# EAGLE design v1.2-no-regulator (EAGLE 9.5.1)
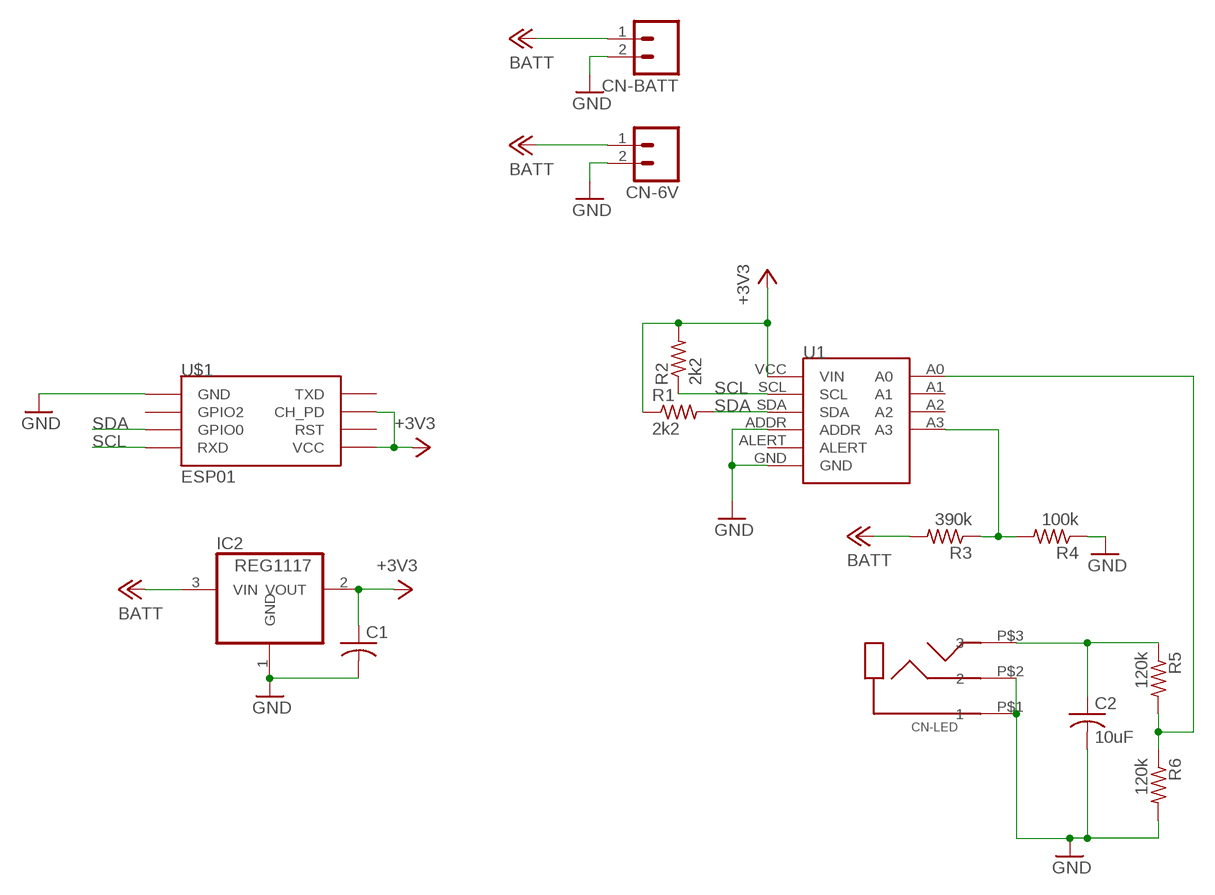
[diagram p0: schematic, sheet 1]

## Parts
C1  C-USC1210  [C1210]
C2  10uF  C-USC0805K  [C0805K]
CN-6V  M02  [02P]
CN-BATT  M02  [02P]
CN-LED  PJ-320B  [PJ-320B]
IC2  REG1117  [SOT223]
R1  2k2  R-US_R0603  [R0603]
R2  2k2  R-US_R0603  [R0603]
R3  390k  R-US_R0603  [R0603]
R4  100k  R-US_R0603  [R0603]
R5  120k  R-US_R0603  [R0603]
R6  120k  R-US_R0603  [R0603]
U1  GY-ADS1115THM  [GY-ADS1115-THM]
U$1  ESP01  [ESP01]

## Nets
+3V3: C1.1 IC2.2(VOUT) R1.1 R2.2 U1.VCC(VIN) U$1.CH_PD U$1.VCC
+6V: CN-6V.1 CN-BATT.1 IC2.3(VIN) R3.2 ; supply symbol labelled BATT
GND: C1.2 C2.2 CN-6V.2 CN-BATT.2 CN-LED.P$1 CN-LED.P$2 IC2.1(GND) R4.1 R6.2 U1.ADDR U1.GND U$1.GND
N$2: R3.1 R4.2 U1.A3
N$3: R5.2 R6.1 U1.A0
N$4: C2.1 CN-LED.P$3 R5.1
SCL: R2.1 U1.SCL U$1.RX(RXD)
SDA: R1.2 U1.SDA U$1.GPIO0
Unconnected: U1.A1 U1.A2 U1.ALERT U$1.GPIO2 U$1.RST U$1.TX(TXD)

## Library data of the parts
C1 C2 = adafruit:C-US: CAPACITOR, American symbol
CN-6V CN-BATT = con-amp-quick:M02: AMP QUICK CONNECTOR; OC_FARNELL: unknown; OC_NEWARK: unknown
CN-LED = serge:PJ-320B
IC2 = burr-brown:REG1117: 800mA and 1A Low Dropout (LDO) Positive Regulator 1.8V, 2.5V, 2.85V, 3.3V, 5V, and Adj; MPN: REG1117; OC_FARNELL: 1097566; OC_NEWARK: 14P6981
R1-R6 = adafruit:R-US_: RESISTOR, American symbol
U1 = serge:GY-ADS1115
U$1 = esp8266modules:ESP01: ESP8266 Wifi module 01

## Board
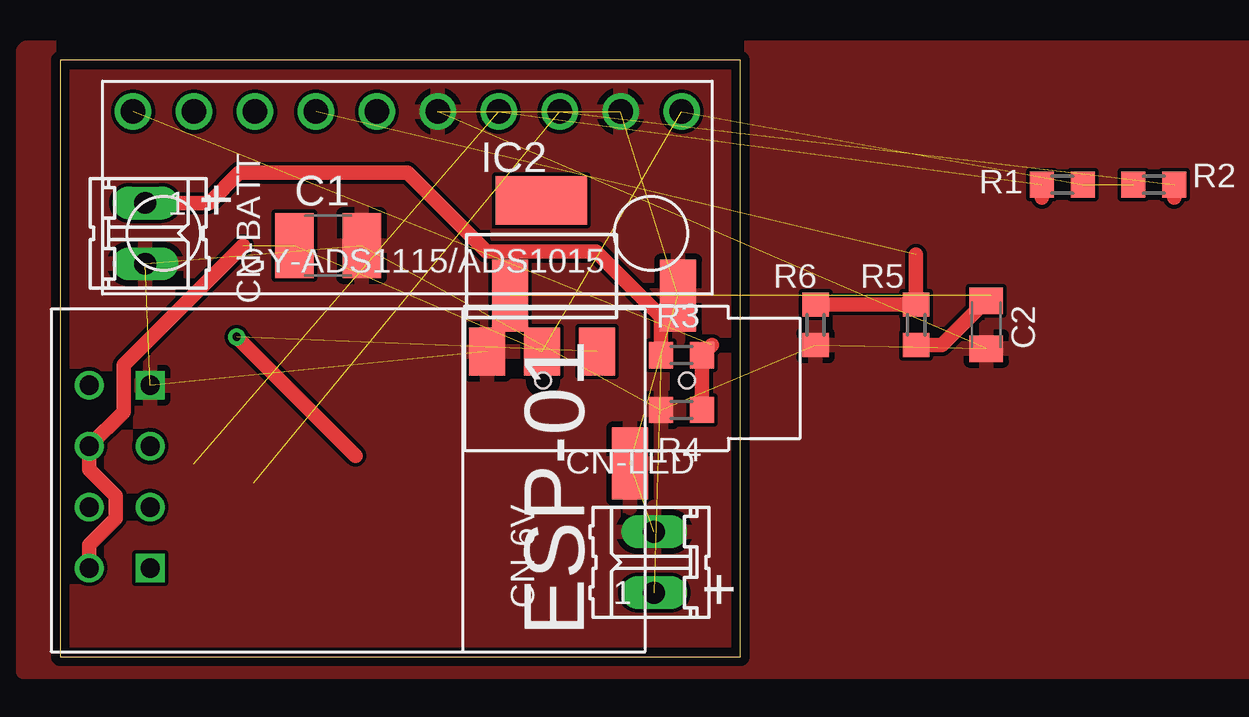
[diagram p1: board, top side]
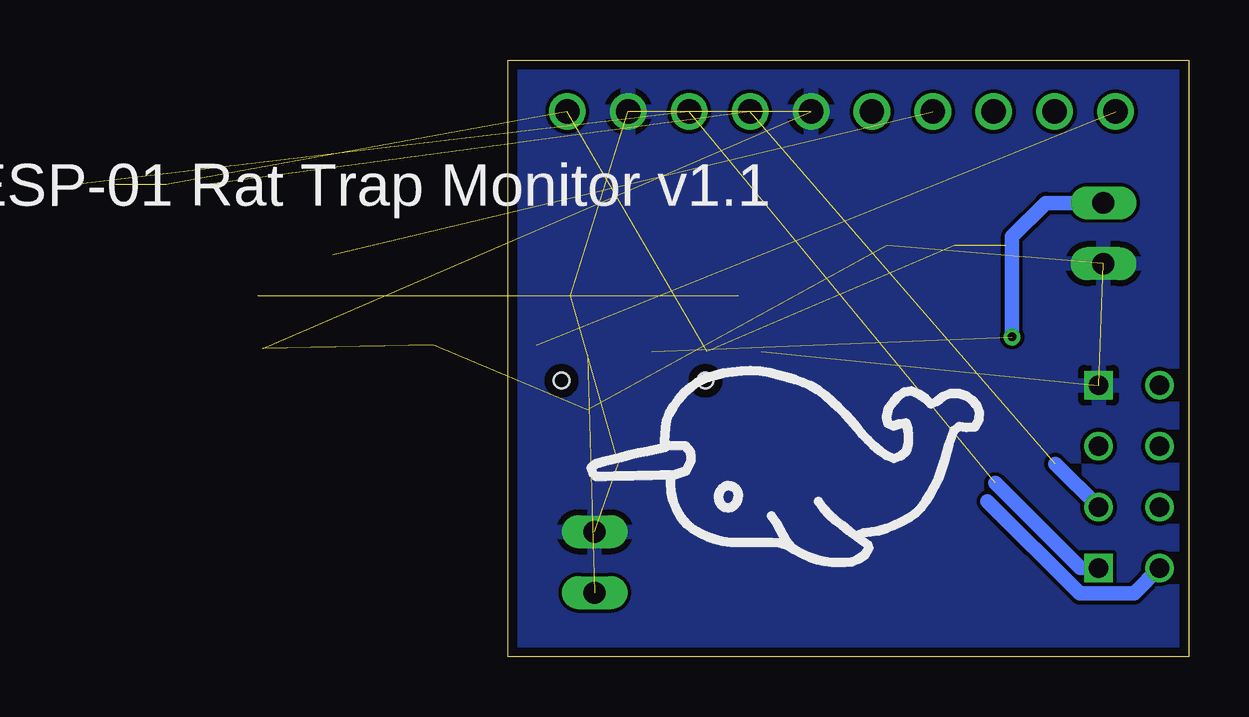
[diagram p2: board, bottom side, seen from below]

Size 28.37 x 24.88 mm. Coordinates in mm from the lower left corner, seen from the top.
Outline: 0,0 28.37,0 28.37,24.88 0,24.88 0,0
Copper layers (1*16): Top 0.0356mm / dielectric 1.5011mm / Bottom 0.0356mm
Design rules "LaenPCBOrder": minimum track width 6mil, minimum drill 13mil, track to track 6mil, track to pad 6mil, pad to pad 6mil, via to via 6mil, smd to smd 6mil, copper to edge 15mil, drill to drill 6mil, minimum pad ring 7mil, minimum via ring 7mil, stop-mask expansion 4mil, vias tented up to drill 0mil, thermal gap 10mil

### Footprints (pad centres in the part's own frame; a part is rotated, then mirrored left to right if it is on the bottom)
C1210 = smd 1.6 x 2.7: 1 -1.4,0; 2 1.4,0
C0805K = smd 1.1 x 1.4: 1 -1,0; 2 1,0
02P = drill 0.914 long: 1 -1.27,0; 2 1.27,0
PJ-320B = smd 1.5 x 3: P$1 -2.393,-3.5; P$2 -0.393,3.5; P$3 4.607,-3.5 | hole 0.65: -2.774,0.048; 3.226,0.048
SOT223 = smd 1.499 x 2.007: 1 -2.261,-3.15; 2 0.025,-3.15; 3 2.311,-3.15 | smd 3.81 x 2.007: 4 0,3.15
R0603 = smd 1 x 1.1: 1 -0.85,0; 2 0.85,0
GY-ADS1115-THM = drill 1.016: A0 -3.81,0; A1 -6.35,0; A2 -8.89,0; A3 -11.43,0; ADDR 1.27,0; ALERT -1.27,0; GND 8.89,0; SCL 6.35,0; SDA 3.81,0; VCC 11.43,0
ESP01 = drill 0.8: CH_PD -1.285,-8.178; GPIO0 1.255,-5.638; GPIO2 -1.285,-5.638; RST 1.255,-8.178; TX -3.825,-8.178; VCC 3.795,-8.178 | drill 0.8 square: GND -3.825,-5.638; RX 3.795,-5.638

### Placement (x,y rotation side)
C1  11.18,17.14 0 top
C2  38.61,13.84 270 top  (outside the outline)
CN-6V  24.77,3.94 90 top
CN-BATT  3.56,17.65 270 top
CN-LED  23.37,11.56 180 top
IC2  20.07,15.88 0 top
R1  41.78,19.68 180 top  (outside the outline)
R2  45.59,19.68 180 top  (outside the outline)
R3  25.91,12.57 180 top
R4  25.91,10.29 0 top
R5  35.69,13.84 90 top  (outside the outline)
R6  31.5,13.84 270 top  (outside the outline)
U1  14.48,22.73 0 top
U$1  9.4,7.49 270 top

### Tracks (layer width: path | path; a pad name or v marks a point on that pad's centre or on a via)
+3V3  (5 unrouted)
  Top 0.61: U$1.VCC 1.22,4.67 2.33,5.78 2.33,6.7 1.22,7.81 U$1.CH_PD 2.65,10.21 2.65,12.16 7.63,17.14
  Bottom 0.61: U$1.VCC 2.28,2.64 4.55,2.64 8.39,6.48
+6V  (via drill 0.35)  (2 unrouted)
  Top 0.61: CN-BATT.1 6.21,18.92 7.48,20.19 14.48,20.19 17.78,16.89 22.35,16.89 25.06,14.19 R3.2 | 12.32,8.38 v7.37,13.34
  Bottom 0.61: CN-BATT.1 5.97,18.92 7.37,17.53 v7.37,13.34
GND  (11 unrouted)
  pour Top: -1.52,-0.64 51.82,-0.64 51.82,25.4 -1.4,25.4 -1.52,25.27
  pour Bottom: -1.52,-0.64 -1.52,25.4 51.94,25.4 51.94,-0.64
N$2  (1 unrouted)
  Top 0.61: 27.18,12.99 R3.1 R4.2
N$3  (1 unrouted)
  Top 0.61: R6.1 R5.2 35.69,16.76
N$4  (1 unrouted)
  Top 0.61: 38.82,15.06 C2.1 36.76,12.99 R5.1
SCL  (2 unrouted)
  Top 0.61: 46.44,19.14 R2.1
  Bottom 0.61: U$1.RX 4.53,3.7 8.07,7.24
SDA  (2 unrouted)
  Top 0.61: 40.93,19.14 R1.2
  Bottom 0.61: 5.57,8.05 U$1.GPIO0

### Text on the board
bPlace: ESP-01 Rat Trap Monitor v1.1
tNames: ⏚ + | + ⏚